# EAGLE design TriggersCV_Circuitry (EAGLE 9.2.1)
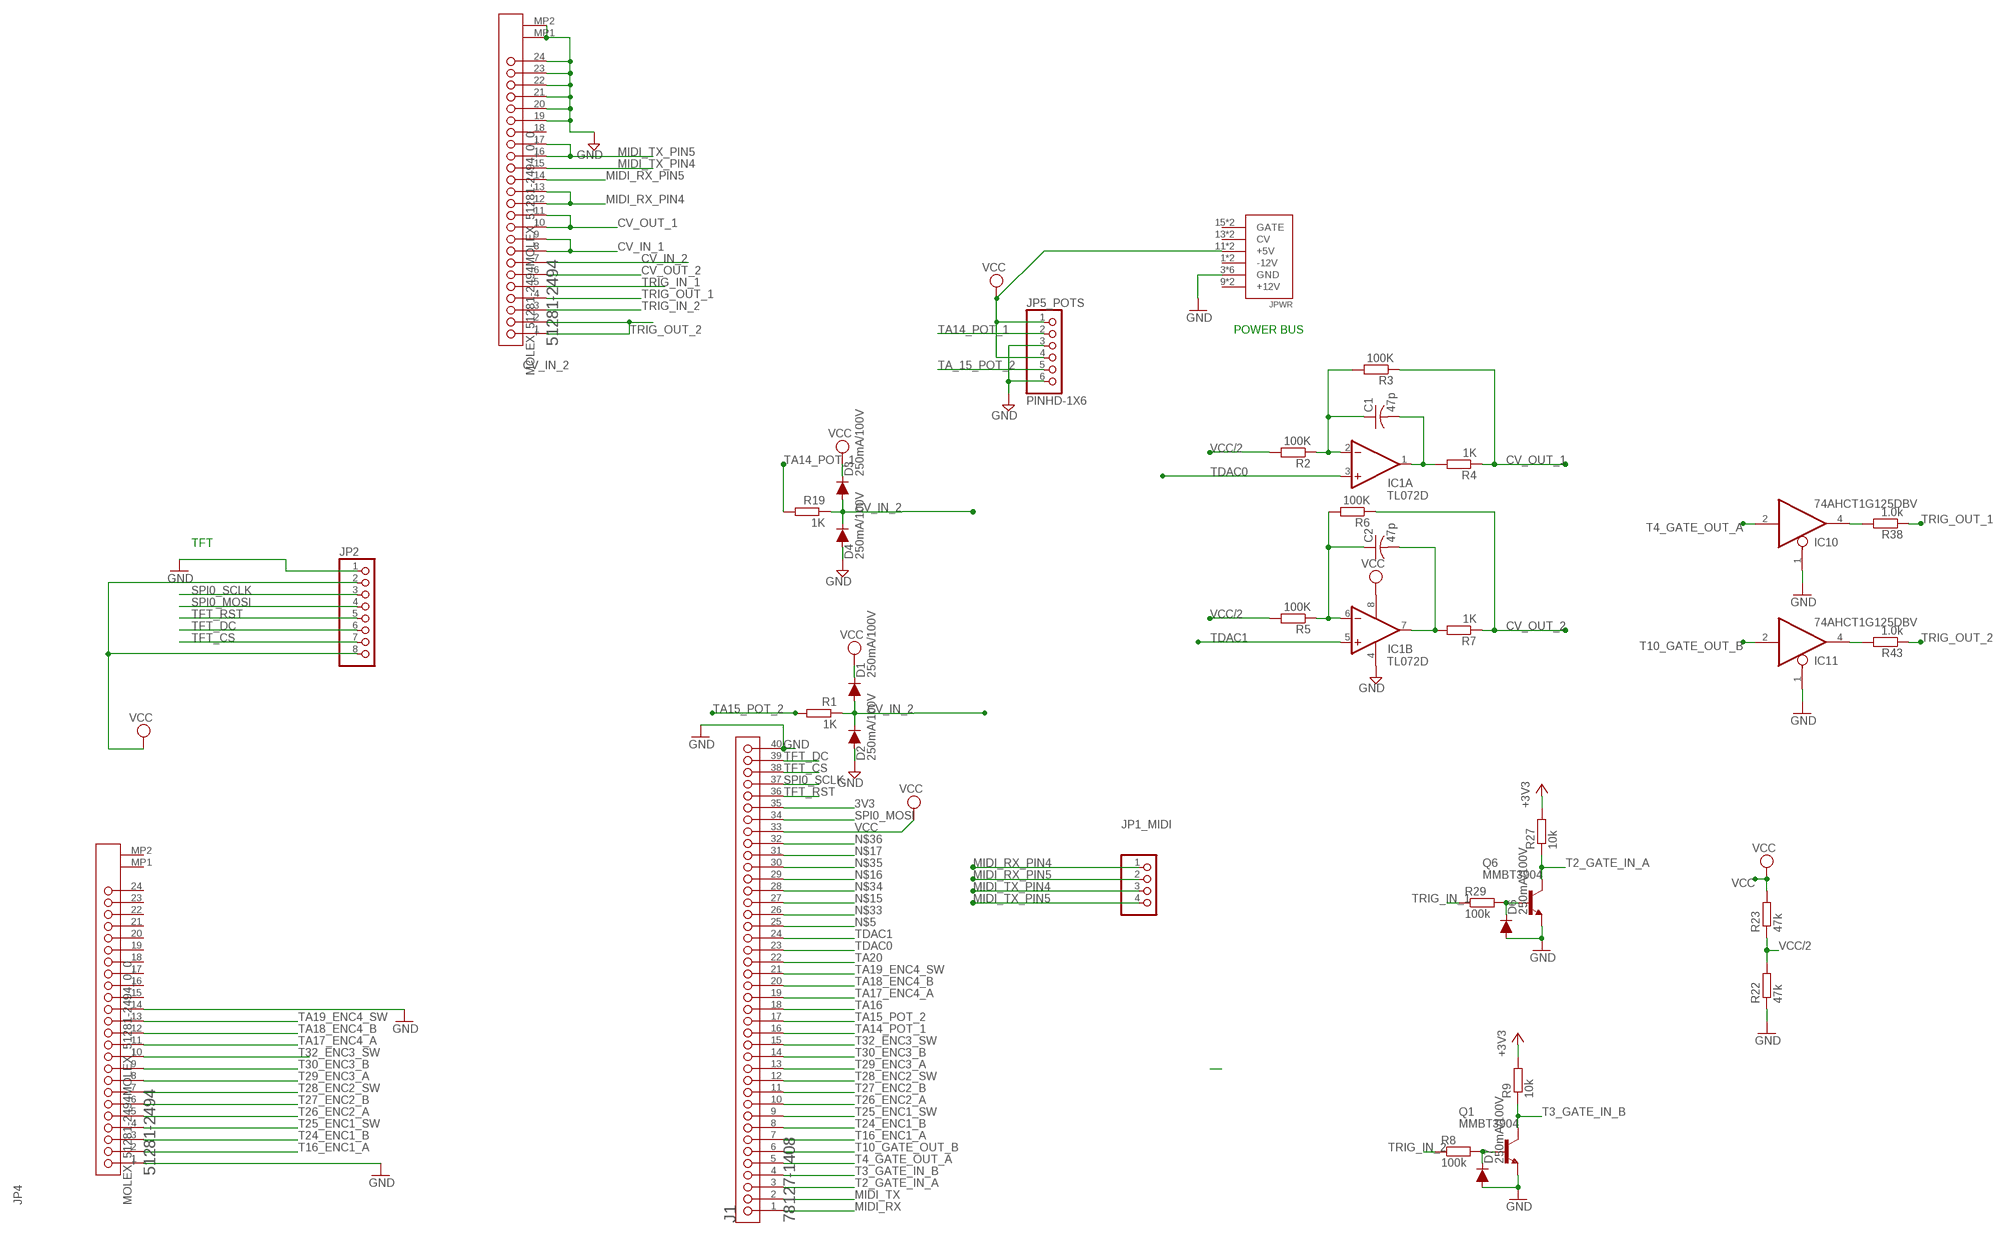
[diagram p0: schematic, sheet 1]

## Parts
C1  47p  C-US025-025X050  [C025-025X050]
C2  47p  C-US025-025X050  [C025-025X050]
D1  250mA/100V  SPARKFUN-DISCRETESEMI_DIODE-BAS16J  [SPARKFUN-DISCRETESEMI_SOD-323]
D2  250mA/100V  SPARKFUN-DISCRETESEMI_DIODE-BAS16J  [SPARKFUN-DISCRETESEMI_SOD-323]
D3  250mA/100V  SPARKFUN-DISCRETESEMI_DIODE-BAS16J  [SPARKFUN-DISCRETESEMI_SOD-323]
D4  250mA/100V  SPARKFUN-DISCRETESEMI_DIODE-BAS16J  [SPARKFUN-DISCRETESEMI_SOD-323]
D6  250mA/100V  SPARKFUN-DISCRETESEMI_DIODE-BAS16J  [SPARKFUN-DISCRETESEMI_SOD-323]
D7  250mA/100V  SPARKFUN-DISCRETESEMI_DIODE-BAS16J  [SPARKFUN-DISCRETESEMI_SOD-323]
IC1  TL072D  [SO08]
IC10  74AHCT1G125DBV  [SOT23-5]
IC11  74AHCT1G125DBV  [SOT23-5]
J1  MOLEX_78127-1408MOLEX_78127-1408_0_0  [MOLEX_78127-1408_0]
JP1_MIDI  PINHD-1X4  [1X04]
JP2  PINHD-1X8  [1X08]
JP3  MOLEX_51281-2494MOLEX_51281-2494_0_0  [MOLEX_51281-2494_0]
JP4  MOLEX_51281-2494MOLEX_51281-2494_0_0  [MOLEX_51281-2494_0]
JP5_POTS  PINHD-1X6  [1X06]
JPWR  POWER  [POWER_16]
Q1  MMBT3904  MMBT3904LT1-NPN-SOT23-BEC  [SOT23-BEC]
Q6  MMBT3904  MMBT3904LT1-NPN-SOT23-BEC  [SOT23-BEC]
R1  1K  R-EU_R0603  [R0603]
R2  100K  R-EU_R0603  [R0603]
R3  100K  R-EU_R0603  [R0603]
R4  1K  R-EU_R0603  [R0603]
R5  100K  R-EU_R0603  [R0603]
R6  100K  R-EU_R0603  [R0603]
R7  1K  R-EU_R0603  [R0603]
R8  100k  R-EU_R0603  [R0603]
R9  10k  R-EU_R0603  [R0603]
R19  1K  R-EU_R0603  [R0603]
R22  47k  R-EU_R0603  [R0603]
R23  47k  R-EU_R0603  [R0603]
R27  10k  R-EU_R0603  [R0603]
R29  100k  R-EU_R0603  [R0603]
R38  1.0k  R-EU_R0603  [R0603]
R43  1.0k  R-EU_R0603  [R0603]

## Nets
3V3: J1.35
+3V3: R9.2 R27.2
CV_IN_1: JP3.8 JP3.9
CV_IN_2: D1.A D2.C D3.A D4.C JP3.7 R1.1 R19.1
CV_OUT_1: JP3.10 JP3.11 R3.1 R4.1
CV_OUT_2: JP3.6 R6.1 R7.1
GND [PWR]: D2.A D4.A D6.A D7.A IC1.4(P:V-) IC10.1(OE) IC11.1(OE) J1.40 JP2.1 JP3.19 JP3.20 JP3.21 JP3.22 JP3.23 JP3.24 JP3.MP1 JP3.MP2 JP4.1 JP4.14 JP5_POTS.3 JP5_POTS.6 JPWR.3(GND) JPWR.4(GND) JPWR.5(GND) JPWR.6(GND) JPWR.7(GND) JPWR.8(GND) Q1.E Q6.E R22.1
MIDI_RX: J1.1
MIDI_RX_PIN4: JP1_MIDI.1 JP3.12 JP3.13
MIDI_RX_PIN5: JP1_MIDI.2 JP3.14
MIDI_TX: J1.2
MIDI_TX_PIN4: JP1_MIDI.3 JP3.15
MIDI_TX_PIN5: JP1_MIDI.4 JP3.16 JP3.17
N$1: C1.1 IC1.2(A:-IN) R2.1 R3.2
N$2: C2.1 IC1.6(B:-IN) R5.1 R6.2
N$3: C1.2 IC1.1(A:OUT) R4.2
N$4: C2.2 IC1.7(B:OUT) R7.2
N$5: J1.25
N$6: D7.C Q1.B R8.2
N$15: J1.27
N$16: J1.29
N$17: J1.31
N$33: J1.26
N$34: J1.28
N$35: J1.30
N$36: J1.32
N$45: IC10.4(O) R38.2
N$46: IC11.4(O) R43.2
N$66: D6.C Q6.B R29.2
SPI0_MOSI: J1.34 JP2.4
SPI0_SCLK: J1.37 JP2.3
T2_GATE_IN_A: J1.3 Q6.C R27.1
T3_GATE_IN_B: J1.4 Q1.C R9.1
T4_GATE_OUT_A: IC10.2(I) J1.5
T10_GATE_OUT_B: IC11.2(I) J1.6
T16_ENC1_A: J1.7 JP4.2
T24_ENC1_B: J1.8 JP4.3
T25_ENC1_SW: J1.9 JP4.4
T26_ENC2_A: J1.10 JP4.5
T27_ENC2_B: J1.11 JP4.6
T28_ENC2_SW: J1.12 JP4.7
T29_ENC3_A: J1.13 JP4.8
T30_ENC3_B: J1.14 JP4.9
T32_ENC3_SW: J1.15 JP4.10
TA14_POT_1: J1.16 JP5_POTS.2 R19.2
TA15_POT_2: J1.17 R1.2
TA16: J1.18
TA17_ENC4_A: J1.19 JP4.11
TA18_ENC4_B: J1.20 JP4.12
TA19_ENC4_SW: J1.21 JP4.13
TA20: J1.22
TA_15_POT_2: JP5_POTS.5
TDAC0: IC1.3(A:+IN) J1.23
TDAC1: IC1.5(B:+IN) J1.24
TFT_CS: J1.38 JP2.7
TFT_DC: J1.39 JP2.6
TFT_RST: J1.36 JP2.5
TRIG_IN_1: JP3.5 R29.1
TRIG_IN_2: JP3.3 R8.1
TRIG_OUT_1: JP3.4 R38.1
TRIG_OUT_2: JP3.1 JP3.2 R43.1
VCC: D1.C D3.C IC1.8(P:V+) J1.33 JP2.2 JP2.8 JP5_POTS.1 JP5_POTS.4 JPWR.11(+5V) JPWR.12(+5V) R23.2
VCC/2: R2.2 R5.2 R22.2 R23.1
Unconnected: JP3.18 JP4.15 JP4.16 JP4.17 JP4.18 JP4.19 JP4.20 JP4.21 JP4.22 JP4.23 JP4.24 JP4.MP1 JP4.MP2 JPWR.1(-12V) JPWR.2(-12V) JPWR.9(+12V) JPWR.10(+12V) JPWR.13(CV) JPWR.14(CV) JPWR.15(GATE) JPWR.16(GATE)

## Notes on the sheet
- POWER BUS
- TFT

## Power pins joined to a net without a drawn wire
GND: IC10.3(GND) IC11.3(GND)
VCC: IC10.5(VCC) IC11.5(VCC)

## Library data of the parts
C1 C2 = resistor:C-US: CAPACITOR, American symbol
D1-D4 D6 D7 = My_Diodes2:SPARKFUN-DISCRETESEMI_DIODE: Diode These are standard reverse protection diodes and small signal diodes. SparkFun Products: SparkFun SparkPunk Sound Kit <https://www.sparkfun.com/products/11177> SparkFun ESP8266 Thing <https://www.sparkfun.com/products/13231>; PROD_ID: DIO-09646; SPICEPREFIX: D
IC1 = linear:TL072: OP AMP
IC10 IC11 = 74xx-little-us:74*1G125: Single Bus Buffer Gate with 3-State Output
J1 = Molex - 78127-1408:MOLEX_78127-1408: MOLX-78127-1408; CIIVA_IDS: 3408375; CIRCUITS_LOADED: 40; CIRCUITS_MAXIMUM: 40; COMPONENT_LINK_1_DESCRIPTION: Manufacturer URL; COMPONENT_LINK_1_URL: http://www.molex.com/molex/index.jsp; COMPONENT_LINK_3_DESCRIPTION: Package Specification; COMPONENT_LINK_3_URL: http://www.molex.com/pdm_docs/sd/781271408_sd.pdf; CONTACT_POSITION: N/A; CURRENT_MAX_PER_CONTACT: 0.5A; DATASHEET: http://www.molex.com/webdocs/datasheets/pdf/en-us/0781271408_FFC_FPC_CONNECTORS.pdf; DURABILITY_MATING_CYCLES_MAX: 20; ENTRY_ANGLE: Vertical; FOOTPRINT_VARIANT_NAME_0: Manufacturer Recommended; IMPORTED: yes; IMPORTED_FROM: vault; IMPORT_TS: 1521852751; MATED_HEIGHT: 4.10mm; MATERIAL___METAL: Copper Alloy; MATERIAL___PLATING_MATING: Gold, Nickel; MF: Molex; MOUNTING_TECHNOLOGY: Surface Mount; MPN: 78127-1408; NUMBER_OF_ROWS: 1; ORIENTATION: Vertical; PACKAGE: 78127-1408; PACKAGE_DESCRIPTION: 40-Lead FPC Connector, Pitch 0.5 mm; PACKAGE_VERSION: Rev. B, 12/2012; PACKING: Tape and Reel; PCB_LOCATOR: No; PCB_RETENTION: None; PITCH___MATING_INTERFACE: 0.50mm; PITCH___TERMINATION_INTERFACE: 0.50mm; POLARIZED_TO_PCB: No; PREFIX: J; RELEASE_DATE: 1411372782; ROHS: Yes; STACKABLE: No; VAULT_GUID: E5897CA6-0582-4375-9835-9615FA3CA204; VAULT_REVISION: 128FEC25-98C6-4972-94BF-262D33D22500; VOLTAGE_MAX: 50V AC
JP1_MIDI = pinhead:PINHD-1X4: PIN HEADER
JP2 = pinhead:PINHD-1X8: PIN HEADER
JP3 JP4 = Molex - 51281-2494:MOLEX_51281-2494: MOLX-51281-2494; CIIVA_IDS: 3405321; CIRCUITS_LOADED: 24; COMPONENT_LINK_1_DESCRIPTION: Manufacturer URL; COMPONENT_LINK_1_URL: http://www.molex.com/molex/index.jsp; COMPONENT_LINK_3_DESCRIPTION: Package Specification; COMPONENT_LINK_3_URL: http://www.molex.com/pdm_docs/sd/512812494_sd.pdf; CONTACT_POSITION: Dual; CURRENT_MAX_PER_CONTACT: 0.5A; DATASHEET: http://www.molex.com/webdocs/datasheets/pdf/en-us/0512812494_FFC_FPC_CONNECTORS.pdf; DURABILITY_MATING_CYCLES_MAX: 20; ENTRY_ANGLE: 90degrees Angle; FOOTPRINT_VARIANT_NAME_0: Manufacturer Recommended; IMPORTED: yes; IMPORTED_FROM: vault; IMPORT_TS: 1521850954; MATED_HEIGHT: 1.20mm; MATERIAL___METAL: Phosphor Bronze; MATERIAL___PLATING_MATING: Gold; MATERIAL___PLATING_TERMINATION: Tin; MF: Molex; MOUNTING_TECHNOLOGY: Surface Mount; MPN: 51281-2494; NUMBER_OF_ROWS: 1; ORIENTATION: Right Angle; PACKAGE: 51281-2494; PACKAGE_DESCRIPTION: 24-Lead FPC Connector, Pitch 0.5 mm; PACKAGE_VERSION: Rev. J, 10/2010; PACKING: Tape and Reel; PCB_LOCATOR: No; PCB_RETENTION: Yes; PITCH___MATING_INTERFACE: 0.50mm; POLARIZED_TO_PCB: Yes; PREFIX: J; RELEASE_DATE: 1411372362; ROHS: Yes; STACKABLE: No; VAULT_GUID: 2A86E2F5-7AAB-4DF7-B6C7-A32DC9881D20; VAULT_REVISION: 5B9E9500-2FB9-49B8-84B2-D92C7FEE26D0; VOLTAGE_MAX: 50V
JP5_POTS = audio amplifier example:PINHD-1X6: PIN HEADER
JPWR = eurorack:POWER
Q1 Q6 = transistor:*-NPN-: NPN Transistror BF959 corrected 2008.03.06
R1-R9 R19 R22 R23 R27 R29 R38 R43 = resistor:R-EU_: RESISTOR, European symbol

## Net classes
1 PWR: width 0.457 mm, clearance 0.203 mm

## Board
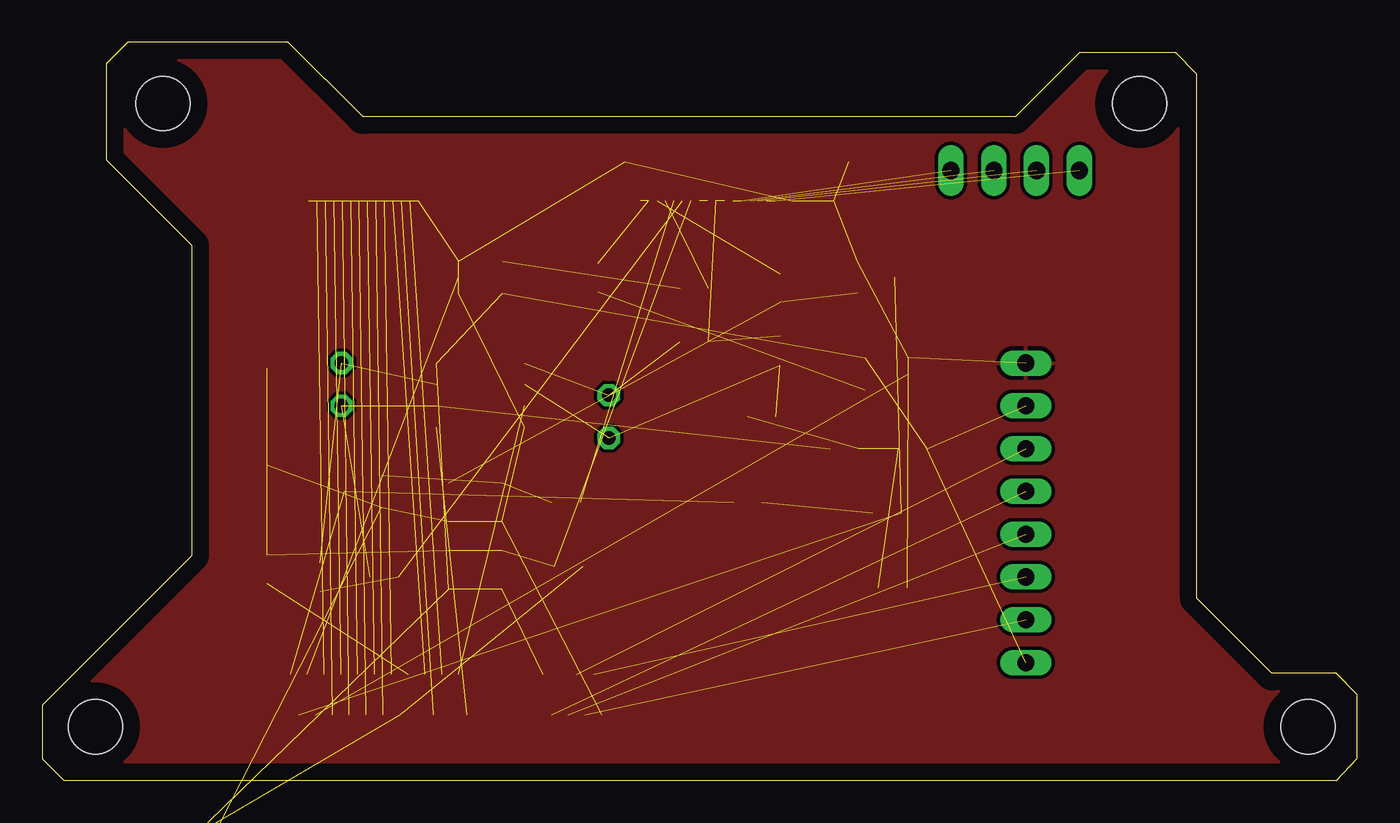
[diagram p1: board, top side]
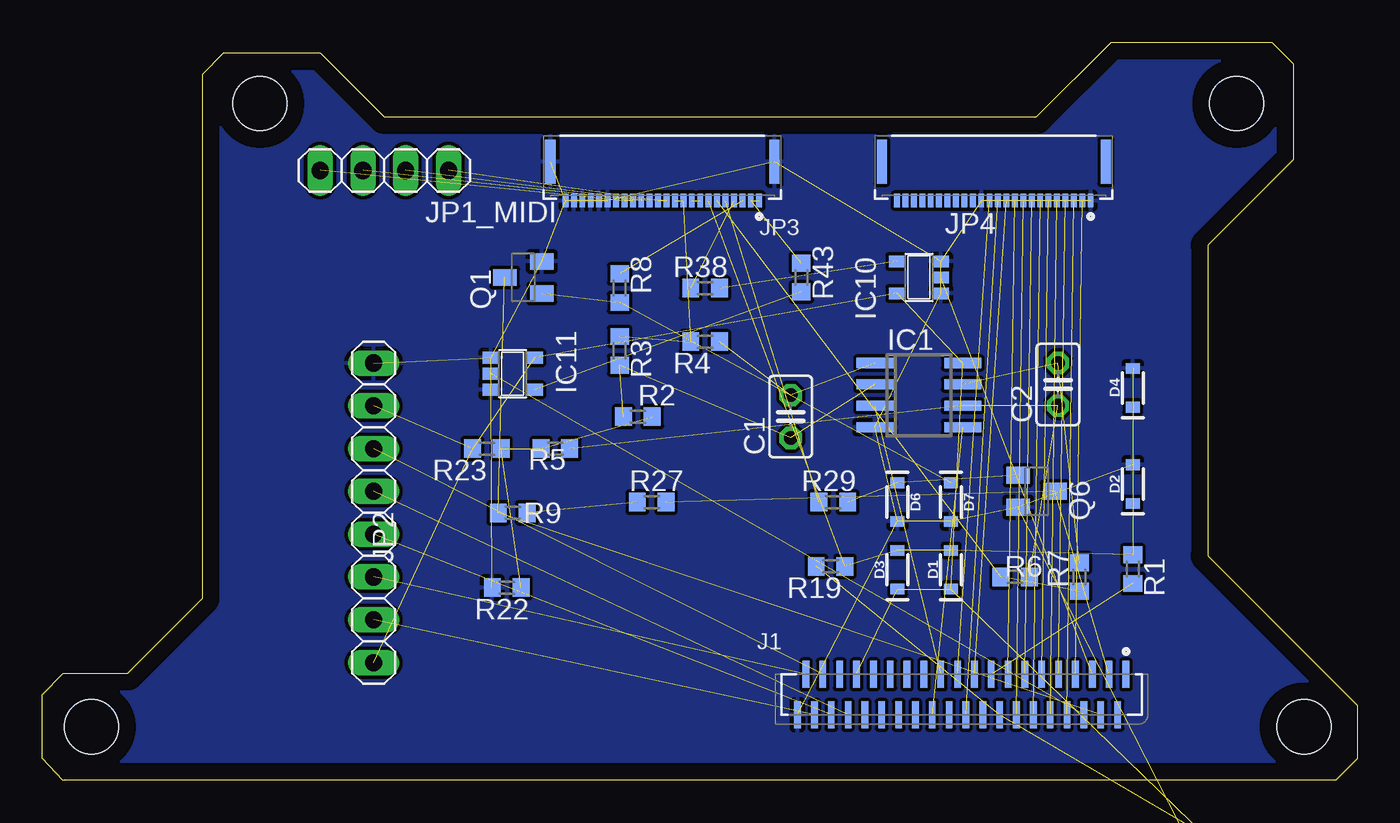
[diagram p2: board, bottom side, seen from below]

Size 78.11 x 43.84 mm. Coordinates in mm from the lower left corner, seen from the top.
Outline: 0,4.46 0,1.29 1.27,0.02 76.83,0.02 76.86,0 78.08,1.31 78.11,5.1 76.84,6.37 73.02,6.37 68.58,10.81 68.58,41.93 67.31,43.2 61.59,43.2 57.78,39.39 19.05,39.39 14.61,43.84 5.08,43.84 3.81,42.56 3.81,36.85 8.89,31.77 8.89,13.36 0,4.46
Copper layers (1*16): Top 0.035mm / dielectric 1.5mm / Bottom 0.035mm
Design rules "default": minimum track width 6mil, minimum drill 0.35mm, track to track 6mil, track to pad 6mil, pad to pad 6mil, via to via 6mil, smd to smd 6mil, copper to edge 40mil, drill to drill 6mil, minimum pad ring 10mil, minimum via ring 8mil, stop-mask expansion 4mil, vias tented up to drill 0mil, thermal gap 10mil
Holes 3.2 mm at 3.17,3.19 75.17,3.19 7.17,40.2 65.17,40.2

### Footprints (pad centres in the part's own frame; a part is rotated, then mirrored left to right if it is on the bottom)
C025-025X050 = drill 0.813 octagon: 1 -1.27,0; 2 1.27,0
SPARKFUN-DISCRETESEMI_SOD-323 = smd 0.63 x 0.83: A 1.15,0; C -1.15,0
SO08 = smd 0.6 x 2.2: 1 -1.905,-2.6; 2 -0.635,-2.6; 3 0.635,-2.6; 4 1.905,-2.6; 5 1.905,2.6; 6 0.635,2.6; 7 -0.635,2.6; 8 -1.905,2.6
SOT23-5 = smd 0.69 x 0.99: 1 -0.95,-1.29; 2 0,-1.29; 3 0.95,-1.29; 4 0.95,1.3; 5 -0.95,1.3
MOLEX_78127-1408_0 = smd 0.4 x 1.6: 1 9.75,1.2; 2 9.25,-1.2; 3 8.75,1.2; 4 8.25,-1.2; 5 7.75,1.2; 6 7.25,-1.2; 7 6.75,1.2; 8 6.25,-1.2; 9 5.75,1.2; 10 5.25,-1.2; 11 4.75,1.2; 12 4.25,-1.2; 13 3.75,1.2; 14 3.25,-1.2; 15 2.75,1.2; 16 2.25,-1.2; 17 1.75,1.2; 18 1.25,-1.2; 19 0.75,1.2; 20 0.25,-1.2; 21 -0.25,1.2; 22 -0.75,-1.2; 23 -1.25,1.2; 24 -1.75,-1.2; 25 -2.25,1.2; 26 -2.75,-1.2; 27 -3.25,1.2; 28 -3.75,-1.2; 29 -4.25,1.2; 30 -4.75,-1.2; 31 -5.25,1.2; 32 -5.75,-1.2; 33 -6.25,1.2; 34 -6.75,-1.2; 35 -7.25,1.2; 36 -7.75,-1.2; 37 -8.25,1.2; 38 -8.75,-1.2; 39 -9.25,1.2; 40 -9.75,-1.2
1X04 = drill 1.016 long: 1 -3.81,0; 2 -1.27,0; 3 1.27,0; 4 3.81,0
1X08 = drill 1.016 long: 1 -8.89,0; 2 -6.35,0; 3 -3.81,0; 4 -1.27,0; 5 1.27,0; 6 3.81,0; 7 6.35,0; 8 8.89,0
MOLEX_51281-2494_0 = smd 0.35 x 0.8: 1 -5.75,1.15; 2 -5.25,1.15; 3 -4.75,1.15; 4 -4.25,1.15; 5 -3.75,1.15; 6 -3.25,1.15; 7 -2.75,1.15; 8 -2.25,1.15; 9 -1.75,1.15; 10 -1.25,1.15; 11 -0.75,1.15; 12 -0.25,1.15; 13 0.25,1.15; 14 0.75,1.15; 15 1.25,1.15; 16 1.75,1.15; 17 2.25,1.15; 18 2.75,1.15; 19 3.25,1.15; 20 3.75,1.15; 21 4.25,1.15; 22 4.75,1.15; 23 5.25,1.15; 24 5.75,1.15 | smd 0.6 x 2.6: MP1 -6.65,-1.15; MP2 6.65,-1.15
1X06 = drill 1.016 octagon: 1 -6.35,0; 2 -3.81,0; 3 -1.27,0; 4 1.27,0; 5 3.81,0; 6 6.35,0
POWER_16 = drill 1.016 pad 1.88 octagon: 1 -6.35,-1.27; 2 -6.35,1.27; 3 -3.81,-1.27; 4 -3.81,1.27; 5 -1.27,-1.27; 6 -1.27,1.27; 7 1.27,-1.27; 8 1.27,1.27; 9 3.81,-1.27; 10 3.81,1.27; 11 6.35,-1.27; 12 6.35,1.27; 13 8.89,-1.27; 14 8.89,1.27; 15 11.43,-1.27; 16 11.43,1.27
SOT23-BEC = smd 1 x 1.4: B -0.95,-1.1; C 0,1.1; E 0.95,-1.1
R0603 = smd 1 x 1.1: 1 -0.85,0; 2 0.85,0

### Placement (x,y rotation side)
C1  33.66,21.61 90 bottom
C2  17.78,23.52 90 bottom
D1  24.13,12.52 90 bottom
D2  13.34,17.6 90 bottom
D3  27.3,12.52 90 bottom
D4  13.34,23.31 90 bottom
D6  27.3,16.53 270 bottom
D7  24.13,16.53 270 bottom
IC1  26.04,22.88 270 bottom
IC10  26.04,29.87 90 bottom
IC11  50.16,24.15 270 bottom
J1  23.5,5.1 0 bottom
JP1_MIDI  57.78,36.22 180 bottom
JP2  58.42,15.89 270 bottom
JP3  41.27,35.58 180 bottom
JP4  21.59,35.58 180 bottom
JP5_POTS  0,-10.78 0 top  (outside the outline)
JPWR  0.63,-19.66 0 top  (outside the outline)
Q1  49.53,29.87 90 bottom
Q6  19.05,17.16 270 bottom
R1  13.34,12.55 270 bottom
R2  42.73,21.61 0 bottom
R3  43.81,25.51 270 bottom
R4  38.73,26.05 0 bottom
R5  47.62,19.71 180 bottom
R6  20.32,12.09 0 bottom
R7  16.51,12.09 90 bottom
R8  43.81,29.23 270 bottom
R9  50.16,15.89 0 bottom
R19  31.28,12.72 180 bottom
R22  50.52,11.45 0 bottom
R23  51.7,19.71 180 bottom
R27  41.91,16.53 180 bottom
R29  31.12,16.53 0 bottom
R38  38.73,29.23 0 bottom
R43  33.02,29.87 270 bottom

### Tracks (layer width: path | path; a pad name or v marks a point on that pad's centre or on a via)
+3V3  (1 unrouted)
CV_IN_1  (1 unrouted)
CV_IN_2  (6 unrouted)
CV_OUT_1  (3 unrouted)
CV_OUT_2  (2 unrouted)
GND  (31 unrouted)
  pour Top: -8.25,59.08 102.23,59.08 102.23,-6.96 -8.25,-6.96
  pour Bottom: -1.91,56.54 90.8,56.54 90.8,-4.43 -1.91,-4.43
MIDI_RX_PIN4  (2 unrouted)
MIDI_RX_PIN5  (1 unrouted)
MIDI_TX_PIN4  (1 unrouted)
MIDI_TX_PIN5  (2 unrouted)
N$1  (3 unrouted)
N$2  (3 unrouted)
N$3  (2 unrouted)
N$4  (2 unrouted)
N$6  (2 unrouted)
N$45  (1 unrouted)
N$46  (1 unrouted)
N$66  (2 unrouted)
SPI0_MOSI  (1 unrouted)
SPI0_SCLK  (1 unrouted)
T2_GATE_IN_A  (2 unrouted)
T3_GATE_IN_B  (2 unrouted)
T4_GATE_OUT_A  (1 unrouted)
T10_GATE_OUT_B  (1 unrouted)
T16_ENC1_A  (1 unrouted)
T24_ENC1_B  (1 unrouted)
T25_ENC1_SW  (1 unrouted)
T26_ENC2_A  (1 unrouted)
T27_ENC2_B  (1 unrouted)
T28_ENC2_SW  (1 unrouted)
T29_ENC3_A  (1 unrouted)
T30_ENC3_B  (1 unrouted)
T32_ENC3_SW  (1 unrouted)
TA14_POT_1  (2 unrouted)
TA15_POT_2  (1 unrouted)
TA17_ENC4_A  (1 unrouted)
TA18_ENC4_B  (1 unrouted)
TA19_ENC4_SW  (1 unrouted)
TDAC0  (1 unrouted)
TDAC1  (1 unrouted)
TFT_CS  (1 unrouted)
TFT_DC  (1 unrouted)
TFT_RST  (1 unrouted)
TRIG_IN_1  (1 unrouted)
TRIG_IN_2  (1 unrouted)
TRIG_OUT_1  (1 unrouted)
TRIG_OUT_2  (2 unrouted)
VCC  (12 unrouted)
VCC/2  (3 unrouted)